# EAGLE design logoi_smd (EAGLE 9.0.0)
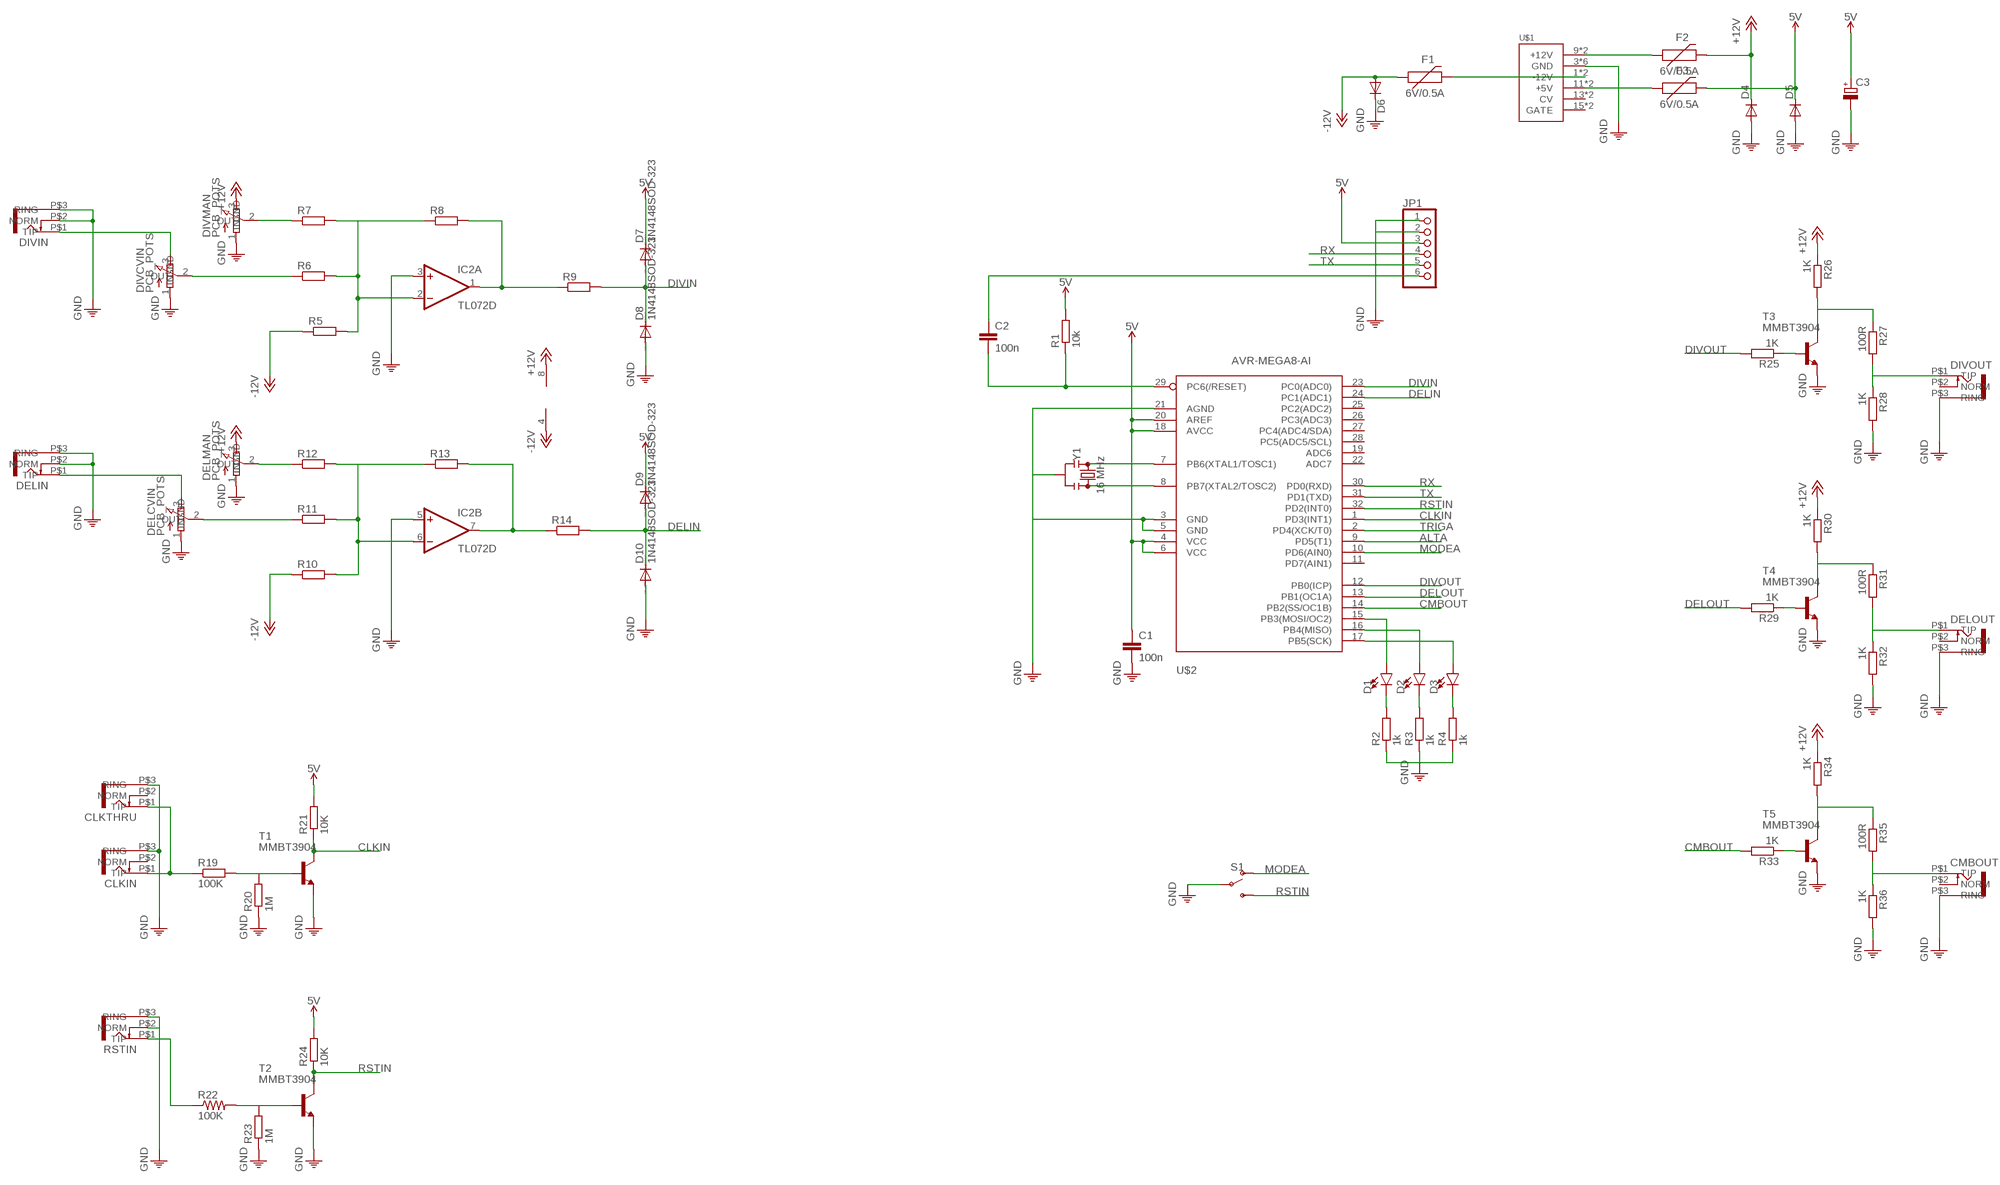
[diagram p0: schematic, sheet 1]

## Parts
C1  100n  CAPACITOR-EUC0603  [C0603]
C2  100n  CAPACITOR-EUC0603  [C0603]
C3  CPOL-EUE2-5  [E2-5]
CLKIN  VERTICALJACKS  [KOBICONN_PJM301DM_JACK]
CLKTHRU  VERTICALJACKS  [KOBICONN_PJM301DM_JACK]
CMBOUT  VERTICALJACKS  [KOBICONN_PJM301DM_JACK]
D1  LED3MM  [LED_3MM]
D2  LED3MM  [LED_3MM]
D3  LED3MM  [LED_3MM]
D4  DIODE-DO-214AC  [DO-214AC]
D5  DIODE-DO-214AC  [DO-214AC]
D6  DIODE-DO-214AC  [DO-214AC]
D7  1N4148SOD-323  [SOD323W_INFINEON]
D8  1N4148SOD-323  [SOD323W_INFINEON]
D9  1N4148SOD-323  [SOD323W_INFINEON]
D10  1N4148SOD-323  [SOD323W_INFINEON]
DELCVIN  PCB_POTS  [ALPHA_9MM_VERTICAL]
DELIN  VERTICALJACKS  [KOBICONN_PJM301DM_JACK]
DELMAN  PCB_POTS  [ALPHA_9MM_VERTICAL]
DELOUT  VERTICALJACKS  [KOBICONN_PJM301DM_JACK]
DIVCVIN  PCB_POTS  [ALPHA_9MM_VERTICAL]
DIVIN  VERTICALJACKS  [KOBICONN_PJM301DM_JACK]
DIVMAN  PCB_POTS  [ALPHA_9MM_VERTICAL]
DIVOUT  VERTICALJACKS  [KOBICONN_PJM301DM_JACK]
F1  6V/0.5A  PPTC_HALF-AMP  [1206]
F2  6V/0.5A  PPTC_HALF-AMP  [1206]
F3  6V/0.5A  PPTC_HALF-AMP  [1206]
IC2  TL072D  [SO08]
JP1  PINHD-1X6  [1X06]
R1  10k  R-EU_R0603  [R0603]
R2  1k  R-EU_R0603  [R0603]
R3  1k  R-EU_R0603  [R0603]
R4  1k  R-EU_R0603  [R0603]
R5  R-EU_R0603  [R0603]
R6  R-EU_R0603  [R0603]
R7  R-EU_R0603  [R0603]
R8  R-EU_R0603  [R0603]
R9  R-EU_R0603  [R0603]
R10  R-EU_R0603  [R0603]
R11  R-EU_R0603  [R0603]
R12  R-EU_R0603  [R0603]
R13  R-EU_R0603  [R0603]
R14  R-EU_R0603  [R0603]
R19  100K  R-EU_R0603  [R0603]
R20  1M  R-EU_R0603  [R0603]
R21  10K  R-EU_R0603  [R0603]
R22  100K  RESISTOR_0805_HAND  [0805_RESISTOR]
R23  1M  R-EU_R0603  [R0603]
R24  10K  R-EU_R0603  [R0603]
R25  1K  R-EU_R0603  [R0603]
R26  1K  R-EU_R0603  [R0603]
R27  100R  R-EU_R0603  [R0603]
R28  1K  R-EU_R0603  [R0603]
R29  1K  R-EU_R0603  [R0603]
R30  1K  R-EU_R0603  [R0603]
R31  100R  R-EU_R0603  [R0603]
R32  1K  R-EU_R0603  [R0603]
R33  1K  R-EU_R0603  [R0603]
R34  1K  R-EU_R0603  [R0603]
R35  100R  R-EU_R0603  [R0603]
R36  1K  R-EU_R0603  [R0603]
RSTIN  VERTICALJACKS  [KOBICONN_PJM301DM_JACK]
S1  SWITCH-SPDT-PTH-11.6X4.0MM  [SWITCH_SPDT_PTH_11.6X4.0MM]
T1  MMBT3904  MMBT3904LT1-NPN-SOT23-BEC  [SOT23-BEC]
T2  MMBT3904  MMBT3904LT1-NPN-SOT23-BEC  [SOT23-BEC]
T3  MMBT3904  MMBT3904LT1-NPN-SOT23-BEC  [SOT23-BEC]
T4  MMBT3904  MMBT3904LT1-NPN-SOT23-BEC  [SOT23-BEC]
T5  MMBT3904  MMBT3904LT1-NPN-SOT23-BEC  [SOT23-BEC]
U$1  POWER  [POWER_16]
U$2  AVR-MEGA8-AI  [TQFP32-08_MCU]
Y1  16 MHz  RESONATORPTH-7.6X3.8  [RESONATOR-PTH-7.6X3.8]

## Nets
5V: C1.1 C3.+ D5.C D7.C D9.C F3.2 JP1.3 R1.2 R21.2 R24.2 U$2.4(VCC) U$2.6(VCC) U$2.18(AVCC) U$2.20(AREF)
+12V: D4.C DELMAN.3(IN) DIVMAN.3(IN) F2.2 IC2.8(P:V+) R26.1 R30.1 R34.1
-12V: D6.A F1.1 IC2.4(P:V-) R5.1 R10.1
ALTA: U$2.9(PD5(T1))
CLKIN: R21.1 T1.C U$2.1(PD3(INT1))
CMBOUT: R33.2 U$2.14(PB2(SS/OC1B))
DELIN: D9.A D10.C R14.2 U$2.24(PC1(ADC1))
DELOUT: R29.2 U$2.13(PB1(OC1A))
DIVIN: D7.A D8.C R9.2 U$2.23(PC0(ADC0))
DIVOUT: R25.2 U$2.12(PB0(ICP))
MODEA: S1.1(O) U$2.10(PD6(AIN0))
N$1: U$2.7(PB6(XTAL1/TOSC1)) Y1.1
N$2: U$2.8(PB7(XTAL2/TOSC2)) Y1.3
N$3 [GND]: F1.2 U$1.1(-12V) U$1.2(-12V)
N$4: C2.2 R1.1 U$2.29(PC6(/RESET))
N$5: C2.1 JP1.6
N$6 [GND]: F3.1 U$1.11(+5V) U$1.12(+5V)
N$7 [GND]: F2.1 U$1.9(+12V) U$1.10(+12V)
N$9: IC2.2(A:-IN) R5.2 R6.2 R7.2 R8.1
N$10: IC2.1(A:OUT) R8.2 R9.1
N$12: R25.1 T3.B
N$13: IC2.6(B:-IN) R10.2 R11.2 R12.2 R13.1
N$14: R26.2 R27.1 T3.C
N$15: IC2.7(B:OUT) R13.2 R14.1
N$17: DIVOUT.P$1(TIP) R27.2 R28.1
N$18: DIVCVIN.3(IN) DIVIN.P$1(TIP)
N$19: DIVCVIN.2(OUT) R6.1
N$20: DIVMAN.2(OUT) R7.1
N$21: D1.K(C) R2.2
N$22: D2.K(C) R3.2
N$23: D3.K(C) R4.2
N$24: D1.A U$2.15(PB3(MOSI/OC2))
N$25: D2.A U$2.16(PB4(MISO))
N$26: D3.A U$2.17(PB5(SCK))
N$27: DELCVIN.2(OUT) R11.1
N$28: DELCVIN.3(IN) DELIN.P$1(TIP)
N$29: DELMAN.2(OUT) R12.1
N$30: CLKIN.P$1(TIP) CLKTHRU.P$1(TIP) R19.1
N$31: R19.2 T1.B
N$33: R22.1 RSTIN.P$1(TIP)
N$34: R22.2 T2.B
N$35: R29.1 T4.B
N$36: R30.2 R31.1 T4.C
N$37: DELOUT.P$1(TIP) R31.2 R32.1
N$39: R33.1 T5.B
N$40: R34.2 R35.1 T5.C
N$41: CMBOUT.P$1(TIP) R35.2 R36.1
PE [GND]: C1.2 C3.- CLKIN.P$3(RING) CLKTHRU.P$3(RING) CMBOUT.P$3(RING) D4.A D5.A D6.C D8.A D10.A DELCVIN.1(GND) DELIN.P$2(NORM) DELIN.P$3(RING) DELMAN.1(GND) DELOUT.P$3(RING) DIVCVIN.1(GND) DIVIN.P$2(NORM) DIVIN.P$3(RING) DIVMAN.1(GND) DIVOUT.P$3(RING) IC2.3(A:+IN) IC2.5(B:+IN) JP1.1 JP1.2 R2.1 R3.1 R4.1 R20.1 R23.1 R28.2 R32.2 R36.2 RSTIN.P$2(NORM) RSTIN.P$3(RING) S1.2(P) T1.E T2.E T3.E T4.E T5.E U$1.3(GND) U$1.4(GND) U$1.5(GND) U$1.6(GND) U$1.7(GND) U$1.8(GND) U$2.3(GND) U$2.5(GND) U$2.21(AGND) Y1.2 ; supply symbol labelled GND
RSTIN: R24.1 S1.3(S) T2.C U$2.32(PD2(INT0))
RX: JP1.4 U$2.30(PD0(RXD))
TRIGA: U$2.2(PD4(XCK/T0))
TX: JP1.5 U$2.31(PD1(TXD))
Unconnected: CLKIN.P$2(NORM) CLKTHRU.P$2(NORM) CMBOUT.P$2(NORM) DELOUT.P$2(NORM) DIVOUT.P$2(NORM) R20.2 R23.2 U$1.13(CV) U$1.14(CV) U$1.15(GATE) U$1.16(GATE) U$2.11(PD7(AIN1)) U$2.19(ADC6) U$2.22(ADC7) U$2.25(PC2(ADC2)) U$2.26(PC3(ADC3)) U$2.27(PC4(ADC4/SDA)) U$2.28(PC5(ADC5/SCL))

## Library data of the parts
C1 C2 = 0000-master:CAPACITOR-EU: CAPACITOR, European symbol
C3 = resistor:CPOL-EU: POLARIZED CAPACITOR, European symbol
CLKIN CLKTHRU CMBOUT DELIN DELOUT DIVIN DIVOUT RSTIN = 0000-master:VERTICALJACKS
D1-D3 = SparkFun-LED:LED: LED (Generic) Standard schematic elements and footprints for 5mm, 3mm, 1206, and 0603 sized LEDs. Generic LEDs with no color specified.; PROD_ID: DIO-08794
D4-D6 = diode:DIODE-: DIODE
D7-D10 = 0000-master:1N4148: DIODE high speed (Philips)
DELCVIN DELMAN DIVCVIN DIVMAN = 0000-master:PCB_POTS: 9 mm Square Rotary Potentiometers Source: Panasonic
F1-F3 = SparkFun-Fuses:PPTC: Resettable Fuse PPTC Resettable Fuse. Really a sort of resistor with a polymeric positive temperature coefficient whose resistance increases dramatically with an increase in temperature. When heated by the power passing through the resistance rises causing the current to be limited, protecting the circuit. This is achieved by the transition of the polymer from a crystalline to an amorphous state where the conductive carbon separates breaking the conductive pathways found in the cool crystalline structure. When a PPTC cools back down it resumes conducting letting the circuit turn back on. SparkFun Products: SparkFun RedBoard - Programmed with Arduino <https://www.sparkfun.com/products/12757> Pro Micro - 5V/16MHz <https://www.sparkfun.com/products/12640> Arduino Pro 328 - 5V/16MHz <https://www.sparkfun.com/products/10915> MP3 Trigger <https://www.sparkfun.com/products/13720>; PROD_ID: RES-08585
IC2 = 0000-master:TL072: OP AMP
JP1 = pinhead:PINHD-1X6: PIN HEADER
R1-R14 R19-R21 R23-R36 = resistor:R-EU_: RESISTOR, European symbol; SPICEPREFIX: R
R22 = 0000-master:RESISTOR_0805_HAND: RES-11622
S1 = SparkFun-Switches:SWITCH-SPDT: Single Pole, Double Throw (SPDT) Switch Single-pole, double-throw (SPDT) switch. Variant Overview SMD-AYZ0202 Surface Mount DPDT Switch <https://www.sparkfun.com/products/597> (COM-00597) Used on e.g. LilyPad Arduino USB - ATmega32U4 Board <https://www.sparkfun.com/products/12049> PTH-11.6X4.0MM SPDT Mini Power Switch <https://www.sparkfun.com/products/102> (COM-00102) Used on e.g. SparkFun Simon Says - Through-Hole Soldering Kit <https://www.sparkfun.com/products/10547> (KIT-10547) PTH-11.6X4.0MM-KIT KIT version of SPDT Mini Power Switch - Simplifies soldering by removing tStop of switch pins - only one side can be soldered. PTH-11.6X4.0MM-LOCK LOCK version of SPDT Mini Power Switch - Offset pins hold switch in place for easier soldering. SMD-RIGHT-ANGLE Surface Mount Right Angle Switch <https://www.sparkfun.com/products/10860> (COM-10860) Used on e.g. SparkFun ESP8266 Thing <https://www.sparkfun.com/products/13231>; PROD_ID: SWCH-08261; SF_SKU: COM-00102
T1-T5 = transistor-neu-to92:*-NPN-: NPN Transistror
U$1 = eurorack:POWER
U$2 = SparkFun-Retired:AVR-MEGA8: MCU 8 Kbytes FLASH 1 kbytes SRAM 512 bytes EEPROM USART 6-channel 10 bit ADC 2-channel 8 bit ADC SparkFun Products None.
Y1 = SparkFun-Clocks:RESONATOR: Resonators (Generic) Ceramic resonators are clock-generating components, often used to control timing in microcontrollers. They usually have 3 pins: two pins for oscillation, and one pin for ground. Compared to crystals, resonators have worse tolerance, but are usually much cheaper. Plus, they have built-in load capacitors! These devices are used on boards like the Arduino Pro 8MHz <https://www.sparkfun.com/products/11114> and Arduino Pro 16MHz <https://www.sparkfun.com/products/11113>.

## Net classes
0 default: width 0.203 mm
1 GND: width 0.305 mm

## Board
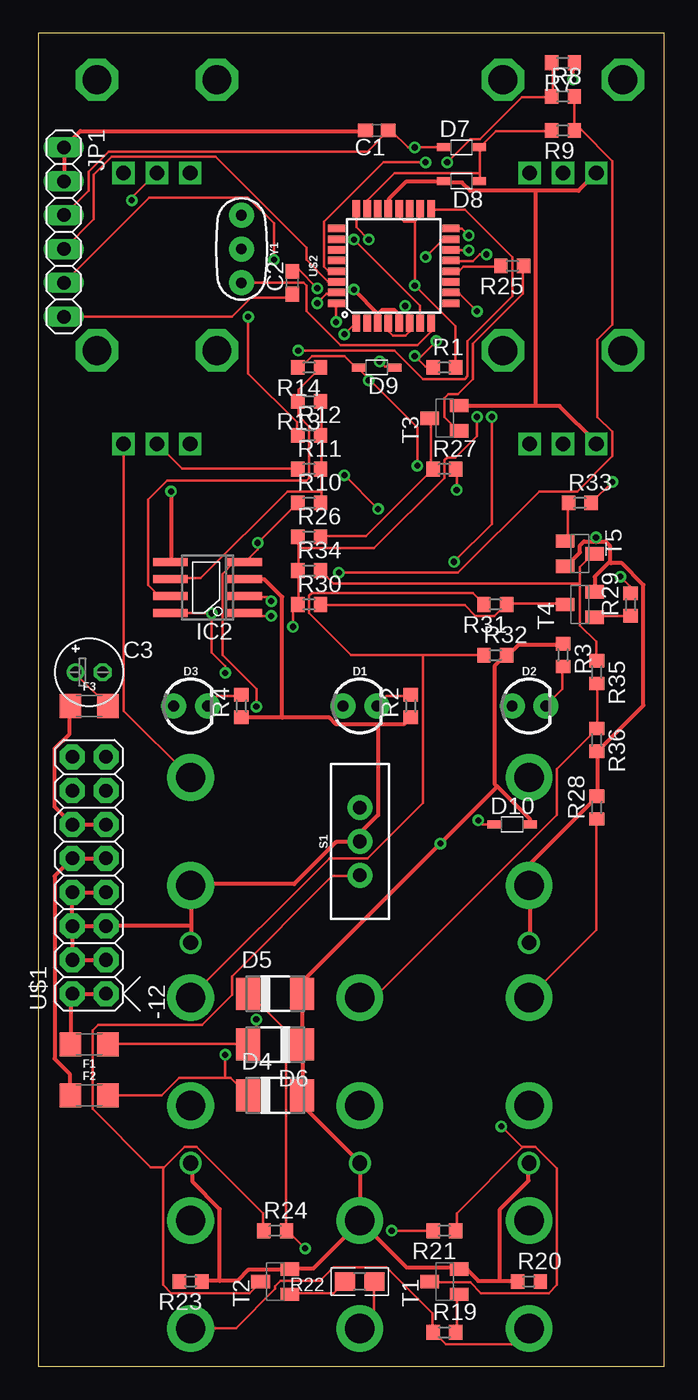
[diagram p1: board, top side]
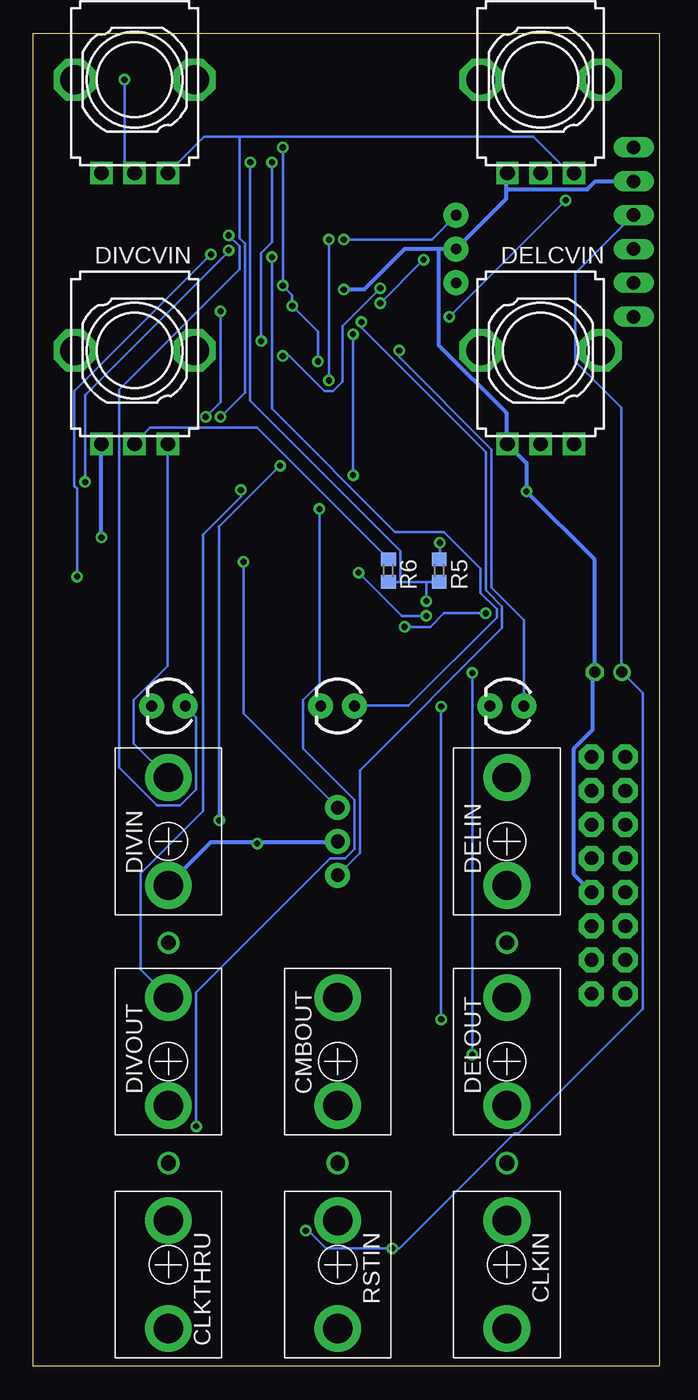
[diagram p2: board, bottom side, seen from below]

Size 46.97 x 100 mm. Coordinates in mm from the lower left corner, seen from the top.
Outline: 0,0 46.97,0 46.97,100 0,100 0,0
Copper layers (1*16): Top 0.035mm / dielectric 1.5mm / Bottom 0.035mm
Design rules "default *": minimum track width 8mil, minimum drill 18mil, track to track 8mil, track to pad 8mil, pad to pad 8mil, via to via 8mil, smd to smd 8mil, copper to edge 40mil, drill to drill 8mil, minimum pad ring 10mil, minimum via ring 8mil, stop-mask expansion 4mil, vias tented up to drill 0mil, thermal gap 10mil

### Footprints (pad centres in the part's own frame; a part is rotated, then mirrored left to right if it is on the bottom)
C0603 = smd 1.1 x 1: 1 -0.85,0; 2 0.85,0
E2-5 = drill 0.813 pad 1.27: + -1.016,0 | drill 0.813 pad 1.27 octagon: - 1.016,0
KOBICONN_PJM301DM_JACK = drill 2.2 pad 3.5: P$1 0,4.8; P$2 0,-3.3 | drill 1.1: P$3 0,-7.6
LED_3MM = drill 0.813 pad 1.88: A -1.27,0; K 1.27,0
DO-214AC = smd 1.8 x 2.4: A 2.025,0; C -2.025,0
SOD323W_INFINEON = smd 1 x 0.6: A 1.35,0; C -1.35,0
ALPHA_9MM_VERTICAL = drill 1.1 pad 1.676 square: 1 -2.5,-7; 2 0,-7; 3 2.5,-7 | drill 2.159 pad 3.175 octagon: M1 4.5,0; M2 -4.5,0
1206 = smd 1.6 x 1.8: 1 -1.4,0; 2 1.4,0
SO08 = smd 0.6 x 2.6: 1 -1.905,-2.8; 2 -0.635,-2.8; 3 0.635,-2.8; 4 1.905,-2.8; 5 1.905,2.8; 6 0.635,2.8; 7 -0.635,2.8; 8 -1.905,2.8
1X06 = drill 1.016 long: 1 -6.35,0; 2 -3.81,0; 3 -1.27,0; 4 1.27,0; 5 3.81,0; 6 6.35,0
R0603 = smd 1 x 1.1: 1 -0.85,0; 2 0.85,0
0805_RESISTOR = smd 1.5 x 1.4: 1 -1.1,0; 2 1.1,0
SWITCH_SPDT_PTH_11.6X4.0MM = drill 1.016 pad 1.88: 1 0,2.54; 2 0,0; 3 0,-2.54
SOT23-BEC = smd 1 x 1.4: B -0.95,-1.1; C 0,1.1; E 0.95,-1.1
POWER_16 = drill 1.016 pad 1.88 octagon: 1 -6.35,-1.27; 2 -6.35,1.27; 3 -3.81,-1.27; 4 -3.81,1.27; 5 -1.27,-1.27; 6 -1.27,1.27; 7 1.27,-1.27; 8 1.27,1.27; 9 3.81,-1.27; 10 3.81,1.27; 11 6.35,-1.27; 12 6.35,1.27; 13 8.89,-1.27; 14 8.89,1.27; 15 11.43,-1.27; 16 11.43,1.27
TQFP32-08_MCU = smd 1.27 x 0.559: 1 -4.293,2.8; 2 -4.293,2; 3 -4.293,1.2; 4 -4.293,0.4; 5 -4.293,-0.4; 6 -4.293,-1.2; 7 -4.293,-2; 8 -4.293,-2.8; 17 4.293,-2.8; 18 4.293,-2; 19 4.293,-1.2; 20 4.293,-0.4; 21 4.293,0.4; 22 4.293,1.2; 23 4.293,2; 24 4.293,2.8 | smd 0.559 x 1.27: 9 -2.8,-4.293; 10 -2,-4.293; 11 -1.2,-4.293; 12 -0.4,-4.293; 13 0.4,-4.293; 14 1.2,-4.293; 15 2,-4.293; 16 2.8,-4.293; 25 2.8,4.293; 26 2,4.293; 27 1.2,4.293; 28 0.4,4.293; 29 -0.4,4.293; 30 -1.2,4.293; 31 -2,4.293; 32 -2.8,4.293
RESONATOR-PTH-7.6X3.8 = drill 0.8 pad 1.88: 1 -2.54,0; 2 0,0; 3 2.54,0

### Placement (x,y rotation side)
C1  25.4,92.71 180 top
C2  19.05,81.28 90 top
C3  3.81,52.07 0 top
CLKIN  11.43,7.62 180 bottom
CLKTHRU  36.83,7.62 180 bottom
CMBOUT  24.13,22.86 0 bottom
D1  24.13,49.53 0 top
D2  36.83,49.53 0 top
D3  11.43,49.53 0 top
D4  17.78,20.32 0 top
D5  17.78,27.94 0 top
D6  17.78,24.13 180 top
D7  31.75,91.44 0 top
D8  31.75,88.9 180 top
D9  25.4,74.93 180 top
D10  35.56,40.64 0 top
DELCVIN  8.89,76.2 0 bottom
DELIN  11.43,39.37 0 bottom
DELMAN  8.89,96.52 0 bottom
DELOUT  11.43,22.86 0 bottom
DIVCVIN  39.37,76.2 0 bottom
DIVIN  36.83,39.37 0 bottom
DIVMAN  39.37,96.52 0 bottom
DIVOUT  36.83,22.86 0 bottom
F1  3.81,24.13 180 top
F2  3.81,20.32 0 top
F3  3.81,49.53 0 top
IC2  12.7,58.42 90 top
JP1  1.91,85.09 270 top
R1  30.48,74.93 0 top
R2  27.94,49.53 90 top
R3  39.37,53.34 270 top
R4  15.24,49.53 90 top
R5  16.51,59.69 270 bottom
R6  20.32,59.69 270 bottom
R7  39.37,97.79 180 top
R8  39.37,95.25 0 top
R9  39.37,92.71 180 top
R10  20.32,64.77 0 top
R11  20.32,67.31 0 top
R12  20.32,69.85 0 top
R13  20.32,72.39 180 top
R14  20.32,74.93 180 top
R19  30.48,2.54 0 top
R20  36.83,6.35 0 top
R21  30.48,10.16 180 top
R22  24.13,6.35 180 top
R23  11.43,6.35 180 top
R24  17.78,10.16 0 top
R25  35.56,82.55 180 top
R26  20.32,62.23 0 top
R27  30.48,67.31 0 top
R28  41.91,41.91 90 top
R29  44.45,57.15 90 top
R30  20.32,57.15 0 top
R31  34.29,57.15 180 top
R32  34.29,53.34 0 top
R33  40.64,64.77 0 top
R34  20.32,59.69 0 top
R35  41.91,52.07 270 top
R36  41.91,46.99 270 top
RSTIN  24.13,7.62 180 bottom
S1  24.13,39.37 0 top
T1  30.48,6.35 90 top
T2  17.78,6.35 90 top
T3  30.48,71.12 90 top
T4  40.64,57.15 90 top
T5  40.64,60.96 270 top
U$1  3.81,34.29 90 top
U$2  26.67,82.55 90 top
Y1  15.24,83.82 270 top

### Tracks (layer width: path | path; a pad name or v marks a point on that pad's centre or on a via)
5V  (via drill 0.46)
  Top 0.203: D5.C 15.85,27.94 18.59,25.2 18.59,10.16 R24.2 18.69,10.16 v20.02,8.84 | v26.52,10.16 R21.2 | v25.6,75.39 26.01,74.98 26.72,74.98 D9.C | v27.53,79.55 27.53,79.15 27.84,78.84 27.84,78.33 U$2.6 27.84,78.23 27.84,77.62 27.53,77.32 26.62,77.32 26.31,77.62 26.31,78.23 U$2.4 | 28.25,85.85 v28.25,81.08 31.29,78.03 31.29,74.98 R1.2 | 28.25,85.85 28.65,86.26 28.65,86.77 U$2.18 | 28.25,85.85 27.43,85.85 27.13,86.16 27.13,86.77 U$2.20 | F3.2 5.18,49.58 2.74,52.02 C3.+ | D7.C v28.25,91.44 27.74,91.44 26.52,92.66 C1.1 26.42,92.66 26.21,92.66 24.69,91.14 5.28,91.14 3.76,89.61 3.76,88.19 1.93,86.36 JP1.3
  Bottom 0.203: v26.52,10.16 26.31,10.16 24.99,8.84 v20.02,8.84 19.51,8.84 10.87,17.48 10.57,17.48 1.22,26.82 1.22,50.49 C3.+ 2.85,52.12 2.85,71.93 6.3,75.39 6.3,81.99 1.93,86.36 JP1.3 | v25.6,75.39 25.6,77.62 v27.53,79.55 27.53,80.37 v28.25,81.08 v28.25,91.44
+12V  (via drill 0.46)
  Top 0.203: F2.2 9.25,20.32 10.57,21.64 14.02,21.64 | 14.02,21.64 14.43,21.64 15.75,20.32 D4.C | 19.51,61.37 19.51,59.74 R34.1 19.51,59.64 19.51,57.2 R30.1 19.41,57.1 19.1,56.79 v19.1,55.47 | 19.51,61.37 19.51,62.18 R26.1 | IC2.8 9.96,56.49 v13.01,56.49 13.01,53.54 14.02,52.53 v14.02,52.02 | v14.02,23.37 14.02,21.64 | v32.92,71.22 32.92,69.8 31.29,68.17 30.68,68.17 30.48,67.97 30.48,66.65 25.2,61.37 19.51,61.37
  Bottom 0.203: 31.5,92.25 34.14,92.25 36.78,89.61 DIVMAN.3 | 31.5,92.25 9.45,92.25 6.81,89.61 6.4,89.61 DELMAN.3 | v13.01,56.49 16.15,56.49 17.17,55.47 v19.1,55.47 | v14.02,52.02 v14.02,23.37 | 31.5,92.25 31.5,84.63 31.09,84.23 31.09,73.05 v32.92,71.22
-12V  (via drill 0.46)
  Top 0.203: R10.1 19.41,64.72 v16.46,61.77 16.46,61.27 15.54,60.35 IC2.4 15.44,60.25 14.63,60.25 13.82,59.44 13.82,53.34 16.36,50.8 v16.36,49.48 | F1.1 5.28,24.18 15.75,24.18 D6.A 15.75,24.28 16.36,24.89 v16.36,26.01
  Bottom 0.203: v16.46,61.77 16.46,60.55 R5.1 | v16.36,26.01 v16.36,49.48
CLKIN  (via drill 0.46)
  Top 0.203: 36.32,16.41 36.37,16.46 37.29,16.46 38.91,14.83 38.91,6.1 38.3,5.49 33.22,5.49 32.41,6.3 29.46,6.3 T1.C | 36.32,16.41 31.39,11.48 31.39,10.16 R21.1 | v22.96,77.42 23.77,78.23 U$2.1 | v25.5,64.31 v22.96,66.85 | 36.32,16.41 v34.75,17.98
  Bottom 0.203: v22.96,66.85 v22.96,77.42 | v25.5,64.31 25.5,51.21 26.72,49.99 26.72,46.33 22.86,42.47 22.86,38.81 23.57,38.1 24.69,38.1 34.75,28.04 v34.75,17.98
CMBOUT  (via drill 0.46)
  Top 0.203: v43.08,66.34 41.55,64.82 R33.2 | v32.31,83.72 30.99,83.72 U$2.14
  Bottom 0.203: v43.08,66.34 43.08,72.85 32.31,83.62 v32.31,83.72
DELIN  (via drill 0.46)
  Top 0.203: D10.C 33.33,40.64 v33.02,40.95 | v28.45,67.56 28.45,70.41 24.84,74.02 | 24.84,74.02 23.98,74.88 D9.A 23.88,74.88 22.96,75.79 20.52,75.79 19.71,74.98 19.51,74.98 R14.2 | v24.79,84.53 23.88,85.45 23.88,86.77 U$2.24 | v24.79,73.97 24.84,74.02
  Bottom 0.203: v33.02,40.95 33.02,62.99 v28.45,67.56 | v24.79,73.97 v24.79,84.53
DELOUT  (via drill 0.46)
  Top 0.203: v43.69,59.23 44.4,58.52 44.4,58.01 R29.2 | v33.63,83.41 33.12,83.41 32.61,82.91 30.99,82.91 U$2.13
  Bottom 0.203: v43.69,59.23 43.69,65.84 43.89,66.04 43.89,73.15 v33.63,83.41
DIVIN
  Top 0.203: 33.12,91.44 33.12,89.51 | 33.12,89.51 33.12,88.9 D8.C | 33.12,91.44 34.34,92.66 38.51,92.66 R9.2 | 33.12,91.44 D7.A | 33.12,89.51 26.72,89.51 24.69,87.48 24.69,86.87 U$2.23
DIVOUT
  Top 0.203: R25.2 34.65,82.5 31.9,82.5 31.6,82.19 30.99,82.19 U$2.12
MODEA  (via drill 0.46)
  Top 0.203: v32.92,79.15 31.6,80.47 30.99,80.47 U$2.10 | v34.04,71.22 34.04,63.2 v31.19,60.35
  Bottom 0.203: v32.92,79.15 32.92,72.34 v34.04,71.22 | v31.19,60.35 31.19,48.97 S1.1
N$1  (via drill 0.46)
  Top 0.203: v23.67,84.53 28.65,79.55 28.65,78.33 U$2.7
  Bottom 0.203: v23.67,84.53 17.07,84.53 Y1.1
N$2
  Top 0.203: Y1.3 19.91,81.28 20.12,81.08 20.12,79.15 22.66,76.61 28.45,76.61 29.46,77.62 29.46,78.23 U$2.8
N$3
  Top 0.305: F1.2 2.44,24.18 2.44,27.84 U$1.2 U$1.1
N$4  (via drill 0.46)
  Top 0.203: v20.93,80.87 19.51,82.3 19.1,82.3 C2.2 | R1.1 29.57,74.98 29.06,74.98 v28.25,75.79 28.55,75.59 v29.87,76.91 | v29.06,90.32 25.91,90.32 21.44,85.85 21.44,82.5 21.74,82.19 22.35,82.19 U$2.29
  Bottom 0.203: v28.25,75.79 27.74,75.79 25.09,73.15 24.49,73.15 23.77,73.86 23.77,78.03 v20.93,80.87 | v29.06,90.32 29.06,84.33 29.87,83.52 v29.87,76.91
N$5
  Top 0.203: JP1.6 14.53,78.74 15.95,80.16 19,80.16 C2.1
N$6
  Top 0.305: F3.1 2.34,49.48 2.34,47.45 1.22,46.33 1.22,41.96 U$1.12 U$1.11
N$7
  Top 0.305: F2.1 2.34,20.32 2.34,21.95 1.22,23.06 1.22,36.78 U$1.10 U$1.9
N$9  (via drill 0.46)
  Top 0.203: R7.2 38.61,97.74 38.61,95.3 R8.1 38.51,95.2 36.27,95.2 33.12,92.05 32.41,92.05 v30.68,90.32 | v17.48,57.4 17.17,57.71 15.54,57.71 IC2.2
  Bottom 0.203: 19.41,58.83 20.32,58.83 R6.2 | 19.41,58.83 17.48,58.83 | 17.48,58.83 16.56,58.83 R5.2 | v30.68,90.32 30.68,72.44 19.41,61.16 19.41,58.83 | 17.48,58.83 v17.48,57.4
N$10  (via drill 0.46)
  Top 0.203: R8.2 40.23,95.2 40.23,92.76 R9.1 40.34,92.76 40.74,92.76 43.08,90.42 43.08,78.13 41.96,77.01 41.96,71.22 43.08,70.1 43.08,68.28 40.44,65.63 37.59,65.63 31.5,59.54 v22.55,59.54 | v17.48,56.29 15.75,56.29 15.54,56.49 IC2.1
  Bottom 0.203: v22.55,59.54 19.3,56.29 v17.48,56.29
N$12
  Top 0.203: R25.1 36.37,82.5 36.37,80.47 32.61,76.71 32.61,74.07 31.5,72.95 30.79,72.95 30.48,72.64 30.48,71.22 31.5,70.21 T3.B
N$13
  Top 0.203: 21.23,65.63 21.23,67.26 R11.2 21.23,67.36 21.23,69.8 R12.2 21.23,69.9 21.23,72.34 R13.1 | 21.23,65.63 21.23,64.82 R10.2 | 21.23,65.63 18.69,65.63 12.19,59.13 9.96,59.13 IC2.6
N$14
  Top 0.203: R26.2 21.23,62.28 24.59,62.28 29.57,67.26 R27.1 29.46,67.26 29.46,71.12 T3.C
N$15
  Top 0.203: R14.1 21.13,74.88 19.51,73.25 19.51,72.44 R13.2 19.51,72.34 19.51,71.32 20.32,70.51 20.32,66.65 20.12,66.45 9.65,66.45 8.23,65.02 8.23,58.62 9.04,57.81 9.86,57.81 IC2.7
N$17  (via drill 0.46)
  Top 0.203: R28.1 41.86,41.05 41.86,32.72 36.88,27.74 DIVOUT.P$1 | v31.39,65.73 31.39,67.26 R27.2
  Bottom 0.203: v31.39,65.73 31.39,65.23 34.24,62.38 34.24,41.66 38.91,36.98 38.91,29.77 36.88,27.74 DIVOUT.P$1
N$18
  Bottom 0.203: DIVCVIN.3 36.88,69.19 36.88,52.53 39.42,49.99 39.42,46.74 36.88,44.2 DIVIN.P$1
N$19
  Bottom 0.203: R6.1 20.32,60.55 30.18,70.41 38.2,70.41 39.32,69.29 DIVCVIN.2
N$20  (via drill 0.46)
  Top 0.203: v40.13,96.52 40.13,97.74 R7.1
  Bottom 0.203: v40.13,96.52 40.13,90.32 39.42,89.61 DIVMAN.2
N$21
  Top 0.203: R2.2 27.94,50.29 26.11,50.29 25.4,49.58 D1.K
N$22
  Top 0.203: R3.2 39.32,52.43 39.32,50.8 38.1,49.58 D2.K
N$23
  Top 0.203: R4.2 15.24,50.29 13.41,50.29 12.7,49.58 D3.K
N$24  (via drill 0.46)
  Top 0.203: v29.06,83.21 30.38,84.53 30.89,84.53 U$2.15
  Bottom 0.203: v29.06,83.21 29.06,71.83 19.81,62.59 16.15,62.59 13.41,59.84 13.41,58.01 12.19,56.79 12.19,56.19 18.8,49.58 22.86,49.58 D1.A
N$25  (via drill 0.46)
  Top 0.203: v32.31,84.84 31.8,85.34 30.99,85.34 U$2.16
  Bottom 0.203: v32.31,84.84 31.5,84.02 31.5,82.3 40.54,73.25 40.54,44.91 37.69,42.06 35.97,42.06 34.75,43.28 34.75,48.67 35.56,49.48 D2.A
N$26  (via drill 0.46)
  Top 0.203: v19.51,76.2 26.72,76.2 28.85,74.07 32,74.07 32.21,74.27 32.21,76.91 35.56,80.26 35.56,83.21 32,86.77 29.57,86.77 U$2.17
  Bottom 0.203: v19.51,76.2 19.51,75.69 12.6,68.78 12.6,58.42 10.16,55.98 D3.A
N$27
  Top 0.203: R11.1 19.41,67.36 10.77,67.36 8.94,69.19 DELCVIN.2
N$28
  Top 0.203: DELCVIN.3 6.4,49.17 11.38,44.2 DELIN.P$1
N$29  (via drill 0.46)
  Top 0.203: v15.75,78.74 15.75,74.47 19.41,70.81 19.41,69.9 R12.1 | v7.01,87.48 7.01,87.68 8.84,89.51 DELMAN.2
  Bottom 0.203: v7.01,87.48 v15.75,78.74
N$30
  Top 0.203: CLKTHRU.P$1 36.78,2.74 35.66,1.63 30.58,1.63 29.67,2.54 R19.1 29.57,2.54 29.57,3.96 26.11,7.42 22.15,7.42 21.13,6.4 18.19,6.4 17.78,5.99 17.78,5.79 14.83,2.85 11.48,2.85 CLKIN.P$1
N$31
  Top 0.203: R19.2 31.39,2.54 31.39,5.28 31.5,5.38 T1.B
N$33
  Top 0.203: R22.1 25.2,6.3 25.2,3.86 24.18,2.85 RSTIN.P$1
N$34
  Top 0.203: T2.B 18.9,5.49 22.15,5.49 22.96,6.3 R22.2
N$35
  Top 0.203: R29.1 44.4,56.29 41.76,56.29 T4.B
N$36
  Top 0.203: R30.2 21.23,57.1 32,57.1 32.82,56.29 34.24,56.29 35.05,57.1 R31.1 35.15,57.2 39.52,57.2 T4.C
N$37
  Top 0.203: 28.85,53.34 23.47,53.34 20.32,56.49 20.32,57.81 20.52,58.01 32.61,58.01 33.43,57.2 R31.2 | 28.85,53.34 R32.1 | 28.85,53.34 28.85,42.27 24.69,38.1 21.84,38.1 11.48,27.74 DELOUT.P$1
N$39
  Top 0.203: R33.1 39.73,64.72 39.73,62.08 39.62,61.98 T5.B
N$40
  Top 0.203: 40.64,58.73 40.64,59.94 41.66,60.96 T5.C | 40.64,58.73 40.64,55.58 41.86,54.36 41.86,52.93 R35.1 | 40.64,58.73 22.15,58.73 21.23,59.64 R34.2
N$41
  Top 0.203: R35.2 41.96,51.21 41.96,47.85 R36.1 41.86,47.75 38.91,44.81 38.91,41.35 25.3,27.74 24.18,27.74 CMBOUT.P$1
PE  (via drill 0.46)
  Top 0.305: DELOUT.P$3 11.48,15.24 CLKIN.P$3 11.58,15.14 11.58,13.82 13.61,11.79 13.61,6.4 | 13.61,6.4 14.94,6.4 15.75,7.21 18.8,7.21 T2.E 19,7.32 20.62,7.32 24.08,10.77 RSTIN.P$2 | 13.61,6.4 12.29,6.4 R23.1 | 34.44,43.48 34.24,43.69 34.24,52.53 35.05,53.34 R32.2 35.26,53.34 36.07,54.15 39.32,54.15 R3.1 | 34.44,43.48 36.88,41.05 36.88,40.64 D10.A | DIVOUT.P$3 36.88,15.24 CLKTHRU.P$3 36.78,15.14 36.78,13.92 34.65,11.79 34.65,6.4 | RSTIN.P$3 24.18,15.24 CMBOUT.P$3 | 34.65,6.4 33.02,6.4 32.21,7.21 31.6,7.21 T1.E 31.5,7.42 27.64,7.42 24.18,10.87 RSTIN.P$2 | 34.65,6.4 35.97,6.4 R20.1 | RSTIN.P$3 24.18,15.14 24.18,10.97 RSTIN.P$2 | RSTIN.P$3 24.08,15.34 19.91,19.51 19.91,20.22 D4.A 19.81,20.32 19.81,24.08 D6.C 19.81,24.28 19.81,27.94 D5.A 19.91,28.04 19.91,28.96 v30.18,39.22 34.44,43.48 | C1.2 24.28,92.66 3.15,92.66 1.93,91.44 JP1.1 1.93,91.34 1.93,88.9 JP1.2 | v9.96,65.63 9.96,60.35 IC2.5 | 25.5,78.94 25.5,78.33 U$2.3 | 25.5,78.94 25.81,79.25 26.72,79.25 27.03,78.94 27.03,78.33 U$2.5 | v23.67,80.77 25.5,78.94 | U$1.6 U$1.4 U$1.3 | U$1.6 U$1.8 U$1.7 | U$1.6 U$1.5 11.48,33.02 | 11.48,33.02 11.48,36.07 DELIN.P$2 11.58,36.17 19.2,36.17 22.35,39.32 24.08,39.32 S1.2 24.18,39.42 24.18,40.03 25.5,41.35 25.5,48.16 | 11.48,33.02 11.48,31.8 DELIN.P$3 | 18.29,48.67 21.84,48.67 22.35,48.16 25.5,48.16 | 18.29,48.67 15.24,48.67 R4.1 | 25.5,48.16 27.43,48.16 27.94,48.67 R2.1 | 18.29,48.67 18.29,57.71 16.97,59.03 15.54,59.03 IC2.3 | 37.29,72.03 39.12,72.03 41.86,69.29 DIVCVIN.1 | 37.29,72.03 31.6,72.03 T3.E | U$2.21 26.31,86.87 26.31,87.58 27.64,88.9 D8.A 30.48,88.8 31.8,88.8 32.41,88.19 37.29,88.19
  Top 0.305: 37.29,88.19 40.54,88.19 DIVMAN.1 | 37.29,88.19 37.29,72.03 | 42.88,60.35 41.76,59.23 41.76,58.12 T4.E | 42.88,60.35 42.88,61.57 42.57,61.87 41.86,61.87 | 41.86,61.87 40.95,61.87 40.64,61.57 40.64,61.06 39.62,60.05 T5.E | 42.88,60.35 42.98,60.25 43.79,60.25 45.41,58.62 45.41,49.58 42.06,46.23 R36.2 41.96,46.13 41.96,42.77 R28.2 41.86,42.67 36.88,37.69 36.88,36.17 DIVIN.P$2 36.88,35.97 36.88,31.8 DIVIN.P$3 | 41.86,61.87 v41.86,62.18
  Bottom 0.305: v23.67,80.77 22.15,80.77 19.1,83.82 16.56,83.82 | 16.56,83.82 Y1.2 11.48,87.58 11.48,88.29 | 11.48,88.29 11.48,89.51 DELMAN.1 | 16.56,83.82 16.56,76.61 11.48,71.53 11.48,69.29 DELCVIN.1 11.38,69.19 9.96,67.77 v9.96,65.63 4.88,60.55 4.88,52.12 C3.- 4.98,52.02 4.98,47.75 6.4,46.33 6.4,36.88 U$1.7 | JP1.2 4.78,88.9 5.38,88.29 11.48,88.29 | v41.86,62.18 DIVCVIN.1 | 30.18,39.32 33.63,39.32 36.78,36.17 DIVIN.P$2 | 30.18,39.32 24.18,39.32 S1.2 | v30.18,39.22 30.18,39.32
RSTIN  (via drill 0.46)
  Top 0.203: 9.4,14.88 9.35,14.83 9.35,6.1 9.96,5.49 15.85,5.49 16.66,6.3 T2.C | 9.4,14.88 10.97,16.46 11.89,16.46 16.87,11.48 16.87,10.16 R24.1 | v22.35,78.33 22.35,79.65 U$2.32 | 9.4,14.88 9.35,14.94 8.43,14.94 4.06,19.3 4.06,25.2 4.47,25.6 12.29,25.6 14.53,27.84 14.53,29.26 22.05,36.78 24.08,36.78 S1.3
  Bottom 0.203: v22.35,78.33 22.35,77.93 13.01,68.58 13.01,58.22 11.79,57 11.79,55.37 22.45,44.7 22.45,38.51 S1.3
RX
  Top 0.203: U$2.30 22.35,81.38 21.74,81.38 20.12,83.01 20.12,83.92 13.31,90.73 5.49,90.73 4.17,89.41 4.17,86.06 1.93,83.82 JP1.4
TX  (via drill 0.46)
  Top 0.203: v20.93,79.76 21.64,80.47 22.35,80.47 U$2.31 | v17.68,83.01 17.68,85.75 15.75,87.68 8.33,87.68 1.93,81.28 JP1.5
  Bottom 0.203: v17.68,83.01 v20.93,79.76